# EAGLE design eTapper1main57 (EAGLE 8.5.2)
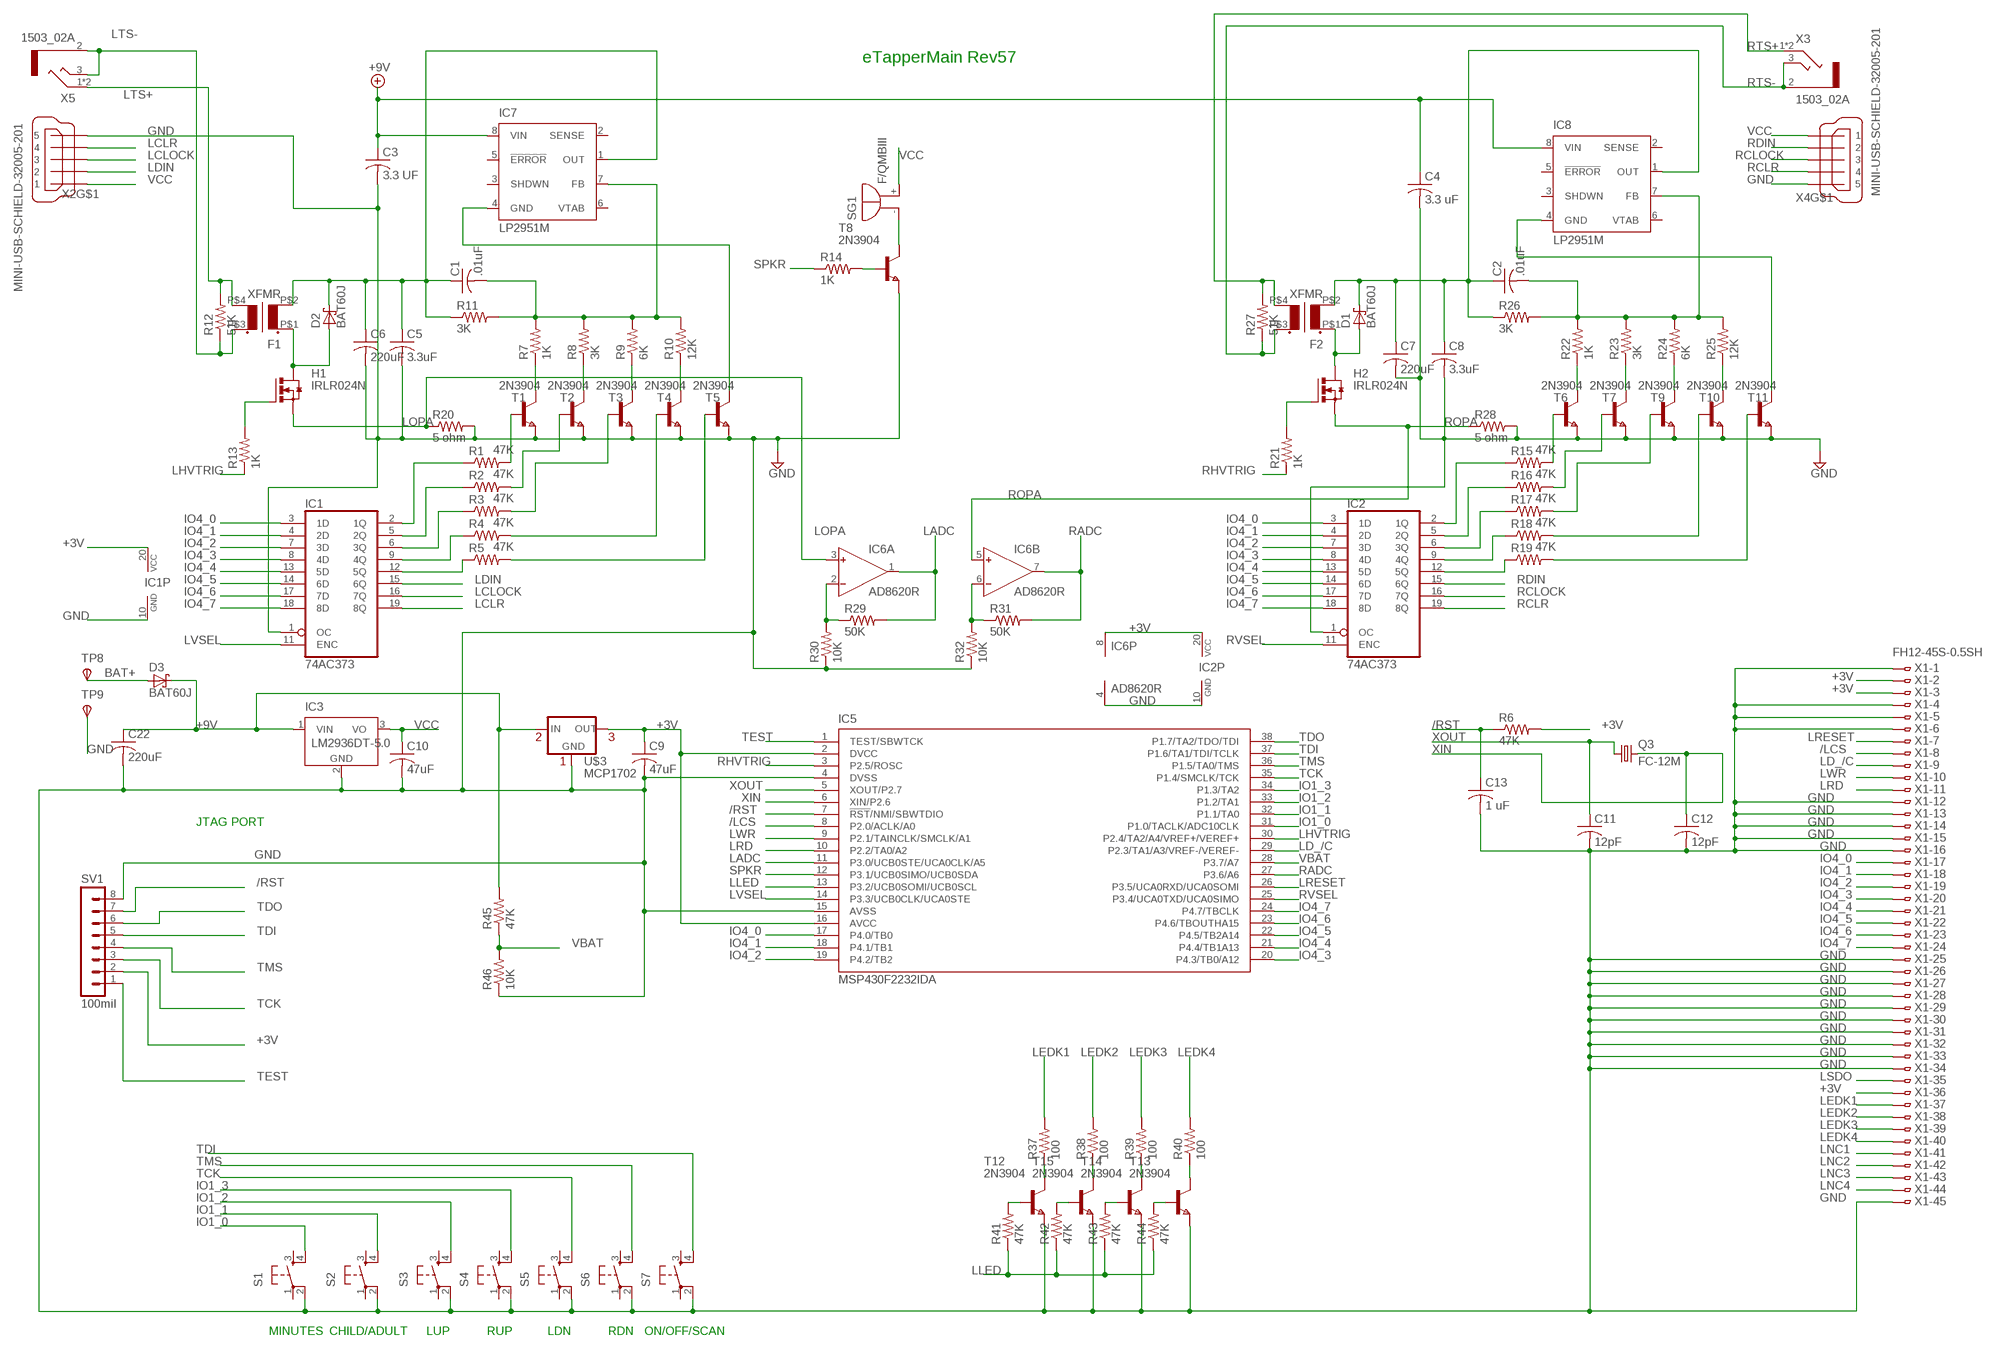
[diagram p0: schematic, sheet 1]

## Parts
C1  .01uF  C-USC0805  [C0805]
C2  .01uF  C-USC0805  [C0805]
C3  3.3 UF  C-USC1206  [C1206]
C4  3.3 uF  C-USC1206  [C1206]
C5  3.3uF  C-USC0805  [C0805]
C6  220uF  C-USC1206  [C1206]
C7  220uF  C-USC1206  [C1206]
C8  3.3uF  C-USC0805  [C0805]
C9  47uF  C-USC1206  [C1206]
C10  47uF  C-USC1206  [C1206]
C11  12pF  C-USC0805  [C0805]
C12  12pF  C-USC0805  [C0805]
C13  1 uF  C-USC0805  [C0805]
C22  220uF  C-USC1206  [C1206]
D1  BAT60J  [SOD323_ST]
D2  BAT60J  [SOD323_ST]
D3  BAT60J  [SOD323_ST]
F1  XFMR  [XFMR]
F2  XFMR  [XFMR]
H1  IRLR024N  [D-PAK_TO252AA]
H2  IRLR024N  [D-PAK_TO252AA]
IC1  74AC373  [SO20]
IC2  74AC373  [SO20]
IC3  LM2936DT-5.0  [TO252]
IC5  MSP430F2232IDA  [TSSOP38_R-PDSO-G38-DA]
IC6  AD8620R  [SO8]
IC7  LP2951M  [SO08]
IC8  LP2951M  [SO08]
Q3  FC-12M  [FC-12M]
R1  47K  R-US_R0603  [R0603]
R2  47K  R-US_R0603  [R0603]
R3  47K  R-US_R0603  [R0603]
R4  47K  R-US_R0603  [R0603]
R5  47K  R-US_R0603  [R0603]
R6  47K  R-US_R0603  [R0603]
R7  1K  R-US_R0603  [R0603]
R8  3K  R-US_R0603  [R0603]
R9  6K  R-US_R0603  [R0603]
R10  12K  R-US_R0603  [R0603]
R11  3K  R-US_R0603  [R0603]
R12  51K  R-US_R0603  [R0603]
R13  1K  R-US_R0603  [R0603]
R14  1K  R-US_R0603  [R0603]
R15  47K  R-US_R0603  [R0603]
R16  47K  R-US_R0603  [R0603]
R17  47K  R-US_R0603  [R0603]
R18  47K  R-US_R0603  [R0603]
R19  47K  R-US_R0603  [R0603]
R20  5 ohm  R-US_R0603  [R0603]
R21  1K  R-US_R0603  [R0603]
R22  1K  R-US_R0603  [R0603]
R23  3K  R-US_R0603  [R0603]
R24  6K  R-US_R0603  [R0603]
R25  12K  R-US_R0603  [R0603]
R26  3K  R-US_R0603  [R0603]
R27  51K  R-US_R0603  [R0603]
R28  5 ohm  R-US_R0603  [R0603]
R29  50K  R-US_R0603  [R0603]
R30  10K  R-US_R0603  [R0603]
R31  50K  R-US_R0603  [R0603]
R32  10K  R-US_R0603  [R0603]
R37  100  R-US_R0603  [R0603]
R38  100  R-US_R0603  [R0603]
R39  100  R-US_R0603  [R0603]
R40  100  R-US_R0603  [R0603]
R41  47K  R-US_R0603  [R0603]
R42  47K  R-US_R0603  [R0603]
R43  47K  R-US_R0603  [R0603]
R44  47K  R-US_R0603  [R0603]
R45  47K  R-US_R0603  [R0603]
R46  10K  R-US_R0603  [R0603]
S1  10-XX  [B3F-10XX]
S2  10-XX  [B3F-10XX]
S3  10-XX  [B3F-10XX]
S4  10-XX  [B3F-10XX]
S5  10-XX  [B3F-10XX]
S6  10-XX  [B3F-10XX]
S7  10-XX  [B3F-10XX]
SG1  F/QMBIII  [F/QMBIII]
SV1  100mil  MA08-1  [MA08-1]
T1  2N3904  NPNSOT23  [SOT-23]
T2  2N3904  NPNSOT23  [SOT-23]
T3  2N3904  NPNSOT23  [SOT-23]
T4  2N3904  NPNSOT23  [SOT-23]
T5  2N3904  NPNSOT23  [SOT-23]
T6  2N3904  NPNSOT23  [SOT-23]
T7  2N3904  NPNSOT23  [SOT-23]
T8  2N3904  NPNSOT23  [SOT-23]
T9  2N3904  NPNSOT23  [SOT-23]
T10  2N3904  NPNSOT23  [SOT-23]
T11  2N3904  NPNSOT23  [SOT-23]
T12  2N3904  NPNSOT23  [SOT-23]
T13  2N3904  NPNSOT23  [SOT-23]
T14  2N3904  NPNSOT23  [SOT-23]
T15  2N3904  NPNSOT23  [SOT-23]
TP8  TPSPAD1-20  [P1-20]
TP9  TPSPAD1-20  [P1-20]
U$3  MCP1702  [TO92-]
X1  FH12-45S-0.5SH  [FH12-45S-0.5SH]
X2  MINI-USB-SCHIELD-32005-201  [32005-201]
X3  1503_02A  [1503_02]
X4  MINI-USB-SCHIELD-32005-201  [32005-201]
X5  1503_02A  [1503_02]

## Nets
+3V [+3V]: C9.1 IC1.20(VCC) IC2.20(VCC) IC5.2(DVCC) IC5.16(AVCC) IC6.8(P:V+) R6.2 SV1.2 U$3.3(OUT) X1.2 X1.3 X1.36
+9V [+9V]: C3.1 C4.1 C22.1 D3.C IC3.1(VIN) IC7.8(VIN) IC8.8(VIN) R45.2 U$3.2(IN)
/LCS: IC5.8(P2.0/ACLK/A0) X1.8
/RST: C13.1 IC5.7(!RST!/NMI/SBWTDIO) R6.1 SV1.7
BAT+ [BAT+]: D3.A TP8.TP(PP)
GND [GND]: C3.2 C4.2 C5.2 C6.2 C7.2 C8.2 C9.2 C10.2 C11.2 C12.2 C13.2 C22.2 IC1.1(OC) IC1.10(GND) IC2.1(OC) IC2.10(GND) IC3.2(GND) IC5.4(DVSS) IC5.15(AVSS) IC6.4(P:V-) R20.2 R28.2 R30.1 R32.1 R46.1 S1.2(P1) S2.2(P1) S3.2(P1) S4.2(P1) S5.2(P1) S6.2(P1) S7.2(P1) SV1.8 T1.2(E) T2.2(E) T3.2(E) T4.2(E) T5.2(E) T6.2(E) T7.2(E) T8.2(E) T9.2(E) T10.2(E) T11.2(E) T12.2(E) T13.2(E) T14.2(E) T15.2(E) TP9.TP(PP) U$3.1(GND) X1.1 X1.4 X1.5 X1.6 X1.12 X1.13 X1.14 X1.15 X1.16 X1.25 X1.26 X1.27 X1.28 X1.29 X1.30 X1.31 X1.32 X1.33 X1.34 X1.45 X2.5 X4.5
IO1_0: IC5.31(P1.0/TACLK/ADC10CLK) S1.4(S1)
IO1_1: IC5.32(P1.1/TA0) S2.4(S1)
IO1_2: IC5.33(P1.2/TA1) S3.4(S1)
IO1_3: IC5.34(P1.3/TA2) S4.4(S1)
IO4_0: IC1.3(1D) IC2.3(1D) IC5.17(P4.0/TB0) X1.17
IO4_1: IC1.4(2D) IC2.4(2D) IC5.18(P4.1/TB1) X1.18
IO4_2: IC1.7(3D) IC2.7(3D) IC5.19(P4.2/TB2) X1.19
IO4_3: IC1.8(4D) IC2.8(4D) IC5.20(P4.3/TB0/A12) X1.20
IO4_4: IC1.13(5D) IC2.13(5D) IC5.21(P4.4/TB1A13) X1.21
IO4_5: IC1.14(6D) IC2.14(6D) IC5.22(P4.5/TB2A14) X1.22
IO4_6: IC1.17(7D) IC2.17(7D) IC5.23(P4.6/TBOUTHA15) X1.23
IO4_7: IC1.18(8D) IC2.18(8D) IC5.24(P4.7/TBCLK) X1.24
LADC: IC5.11(P3.0/UCB0STE/UCA0CLK/A5) IC6.1(A:OUT) R29.2
LCLOCK: IC1.16(7Q) X2.3
LCLR: IC1.19(8Q) X2.4
LD_/C: IC5.29(P2.3/TA1/A3/VREF-/VEREF-) X1.9
LDIN: IC1.15(6Q) X2.2
LEDK1: R37.2 X1.37
LEDK2: R38.2 X1.38
LEDK3: R39.2 X1.39
LEDK4: R40.2 X1.40
LHVTRIG: IC5.30(P2.4/TA2/A4/VREF+/VEREF+) R13.1
LLED: IC5.13(P3.2/UCB0SOMI/UCB0SCL) R41.1 R42.1 R43.1 R44.1
LNC1: X1.41
LNC2: X1.42
LNC3: X1.43
LNC4: X1.44
LOPA: H1.3(S) IC6.3(A:IN+) R20.1
LRD: IC5.10(P2.2/TA0/A2) X1.11
LRESET: IC5.26(P3.5/UCA0RXD/UCA0SOMI) X1.7
LSDO: X1.35
LTS+: F1.P$4(S2) R12.2 X5.1 X5.4
LTS-: F1.P$3(S1) R12.1 X5.2 X5.3
LVSEL: IC1.11(ENC) IC5.14(P3.3/UCB0CLK/UCA0STE)
LWR: IC5.9(P2.1/TAINCLK/SMCLK/A1) X1.10
N$1: IC1.2(1Q) R1.1
N$2: IC1.5(2Q) R2.1
N$3: IC1.6(3Q) R3.1
N$4: IC1.9(4Q) R4.1
N$5: IC1.12(5Q) R5.1
N$6: SG1.-(+) T8.1(C)
N$7: R4.2 T4.3(B)
N$8: R5.2 T5.3(B)
N$9: D2.A F1.P$1(P1) H1.4(D)
N$10: R7.1 T1.1(C)
N$11: R8.1 T2.1(C)
N$12: R9.1 T3.1(C)
N$13: R1.2 T1.3(B)
N$14: R2.2 T2.3(B)
N$15: R3.2 T3.3(B)
N$16: R10.1 T4.1(C)
N$17: C1.2 IC7.7(FB) R7.2 R8.2 R9.2 R10.2 R11.2
N$18: C1.1 C5.1 C6.1 D2.C F1.P$2(P2) IC7.1(OUT) R11.1
N$19: D1.A F2.P$1(P1) H2.4(D)
N$20: IC2.2(1Q) R15.1
N$21: H1.1(G) R13.2
N$22: R14.2 T8.3(B)
N$24: IC2.5(2Q) R16.1
N$25: IC2.6(3Q) R17.1
N$26: IC2.9(4Q) R18.1
N$27: IC2.12(5Q) R19.1
N$28: R44.2 T13.3(B)
N$29: R15.2 T6.3(B)
N$30: R16.2 T7.3(B)
N$31: R17.2 T9.3(B)
N$32: R18.2 T10.3(B)
N$33: R19.2 T11.3(B)
N$35: R22.1 T6.1(C)
N$36: R23.1 T7.1(C)
N$37: R24.1 T9.1(C)
N$38: R25.1 T10.1(C)
N$39: C2.2 IC8.7(FB) R22.2 R23.2 R24.2 R25.2 R26.2
N$40: C2.1 C7.1 C8.1 D1.C F2.P$2(P2) IC8.1(OUT) R26.1
N$41: R37.1 T12.1(C)
N$42: H2.1(G) R21.2
N$43: R38.1 T15.1(C)
N$44: R39.1 T14.1(C)
N$45: IC7.4(GND) T5.1(C)
N$46: R40.1 T13.1(C)
N$47: IC8.4(GND) T11.1(C)
N$48: R43.2 T14.3(B)
N$49: R41.2 T12.3(B)
N$50: R42.2 T15.3(B)
N$52: IC6.6(B:IN-) R31.1 R32.2
N$54: IC6.2(A:IN-) R29.1 R30.2
RADC: IC5.27(P3.6/A6) IC6.7(B:OUT) R31.2
RCLOCK: IC2.16(7Q) X4.3
RCLR: IC2.19(8Q) X4.4
RDIN: IC2.15(6Q) X4.2
RHVTRIG: IC5.3(P2.5/ROSC) R21.1
ROPA: H2.3(S) IC6.5(B:IN+) R28.1
RTS+: F2.P$4(S2) R27.2 X3.1 X3.4
RTS-: F2.P$3(S1) R27.1 X3.2 X3.3
RVSEL: IC2.11(ENC) IC5.25(P3.4/UCA0TXD/UCA0SIMO)
SPKR: IC5.12(P3.1/UCB0SIMO/UCB0SDA) R14.1
TCK: IC5.35(P1.4/SMCLK/TCK) S5.4(S1) SV1.3
TDI: IC5.37(P1.6/TA1/TDI/TCLK) S7.4(S1) SV1.5
TDO: IC5.38(P1.7/TA2/TDO/TDI) SV1.6
TEST: IC5.1(TEST/SBWTCK) SV1.1
TMS: IC5.36(P1.5/TA0/TMS) S6.4(S1) SV1.4
VBAT: IC5.28(P3.7/A7) R45.1 R46.2
VCC [VCC]: C10.1 IC3.3(VO) SG1.+(-) X2.1 X4.1
XIN: C12.1 IC5.6(XIN/P2.6) Q3.2
XOUT: C11.1 IC5.5(XOUT/P2.7) Q3.1
Unconnected: IC7.2(SENSE) IC7.3(SHDWN) IC7.5(!ERROR) IC7.6(VTAB) IC8.2(SENSE) IC8.3(SHDWN) IC8.5(!ERROR) IC8.6(VTAB) S1.1(P) S1.3(S) S2.1(P) S2.3(S) S3.1(P) S3.3(S) S4.1(P) S4.3(S) S5.1(P) S5.3(S) S6.1(P) S6.3(S) S7.1(P) S7.3(S) X2.M1(S:S1) X2.M2(S:S2) X2.M3(S:S3) X2.M4(S:S4) X4.M1(S:S1) X4.M2(S:S2) X4.M3(S:S3) X4.M4(S:S4)

## Notes on the sheet
- eTapperMain Rev57
- JTAG PORT
- MINUTES | CHILD/ADULT | LUP | RUP | LDN | RDN | ON/OFF/SCAN

## Library data of the parts
C1-C13 C22 = rcl:C-US: CAPACITOR, American symbol; SPICEPREFIX: C
D1-D3 = diode:BAT60J: Schottky barrier diode Source: www.st.com, BAT60J.pdf
F1 F2 = XFMR1:XFMR: Transformer 1"X1" 0.4"X0.4" hole separation for e_tapper
H1 H2 = IRLR024N:IRLR024N: IRLR024N HEXFET Power Mosfet N channel Infeneon Technology TO-251AA IPAK
IC1 IC2 = 74373_SO20:74*373: Octal D type transparent LATCH, edge triggered
IC3 = national-semiconductor:LM2936?*: Ultra-Low Quiescent Current LDO Voltage Regulator Source: Data sheet <http://www.national.com/ds/LM/LM2936.pdf>; MF: NATIONAL SEMICONDUCTOR; MPN: LM2936DT-5.0/NOPB; OC_FARNELL: 1286864; OC_NEWARK: 41K4501
IC5 = texas:MSP430F22*2IDA: MIXED SIGNAL MICROCONTROLLER Source: http://focus.ti.com/lit/ds/symlink/msp430f2274.pdf; MPN: MSP430F2232IDA; OC_FARNELL: 1610178; OC_NEWARK: 28M6312
IC6 = analog-devices:AD8620: Precision, Very Low Noise, Low Input Bias Current, Wide Bandwidth JFET Operational Amplifiers Source: http://www.analog.com/static/imported-files/data_sheets/AD8610_8620.pdf; MF: ALTERA CORPORATION; MPN: AD8620ARZ; OC_FARNELL: 9994386; OC_NEWARK: 59K6972
IC7 IC8 = national-semiconductor:LP2951: Adjustable Micropower Voltage Regulator Source: http://www.national.com/ds/LP/LP2950.pdf; MF: FAIRCHILD SEMICONDUCTOR; MPN: LP2951CM; OC_FARNELL: 9488561; OC_NEWARK: 78K6014
Q3 = crystal:FC-12M: kHz RANGE CRYSTAL UNIT LOW PROFILE SMD Source: Epson Toyocom FC-12M.pdf
R1-R32 R37-R46 = resistor:R-US_: RESISTOR, American symbol
S1-S7 = switch-omron:10-XX: OMRON SWITCH; MPN: B3F-1000; OC_FARNELL: 176432; OC_NEWARK: 36M3542
SG1 = buzzer:F/QMBIII: BUZZER Source: Buerklin; OC_FARNELL: unknown; OC_NEWARK: unknown
SV1 = eTapper1main39:MA08-1: PIN HEADER; OC_FARNELL: unknown; OC_NEWARK: unknown
T1-T15 = zetex:NPNSOT23: NPN TRANSISTOR; MPN: DSS20201L-7; OC_FARNELL: 1710688; OC_NEWARK: 25R4555
TP8 TP9 = testpad:TPS: TEST PIN
U$3 = mcp1702:MCP1702: MCP1702 LDO Fixed Voltage regulator
X1 = con-hirose:FH12-45S-0.5S: 0.5mm Pitch Connectors For FPC/FFC Source: Data sheet <http://www.hirose.co.jp/cataloge_hp/e58605370.pdf>; OC_FARNELL: unknown; OC_NEWARK: unknown
X2 X4 = con-cypressindustries:MINI-USB-SCHIELD-: MINI USB-B Conector Source: www.cypressindustries.com; OC_FARNELL: unknown; OC_NEWARK: unknown
X3 X5 = 1503_02Astereojacks:1503_02A

## Module LP2951
Ports: 

### Library data of the parts

## Net classes
1 GND: width 0.305 mm, clearance 0.152 mm
2 BAT+: width 0.305 mm, clearance 0.152 mm
3 +9V: width 0.305 mm, clearance 0.152 mm
4 +3V: width 0.305 mm, clearance 0.152 mm
5 VCC: width 0.305 mm, clearance 0.152 mm

## Board
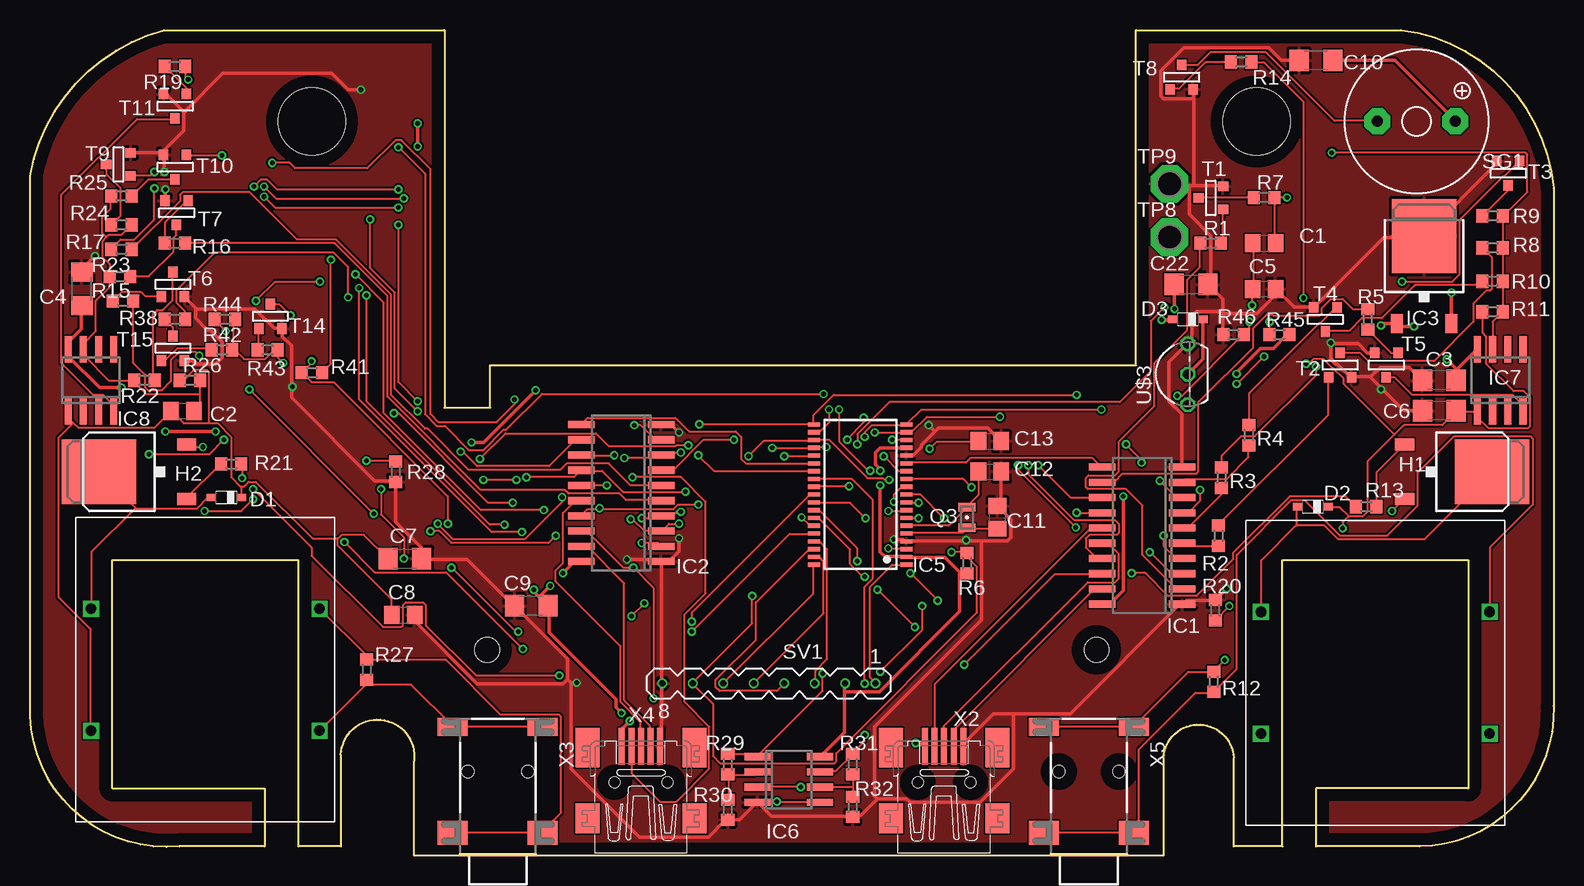
[diagram p1: board, top side]
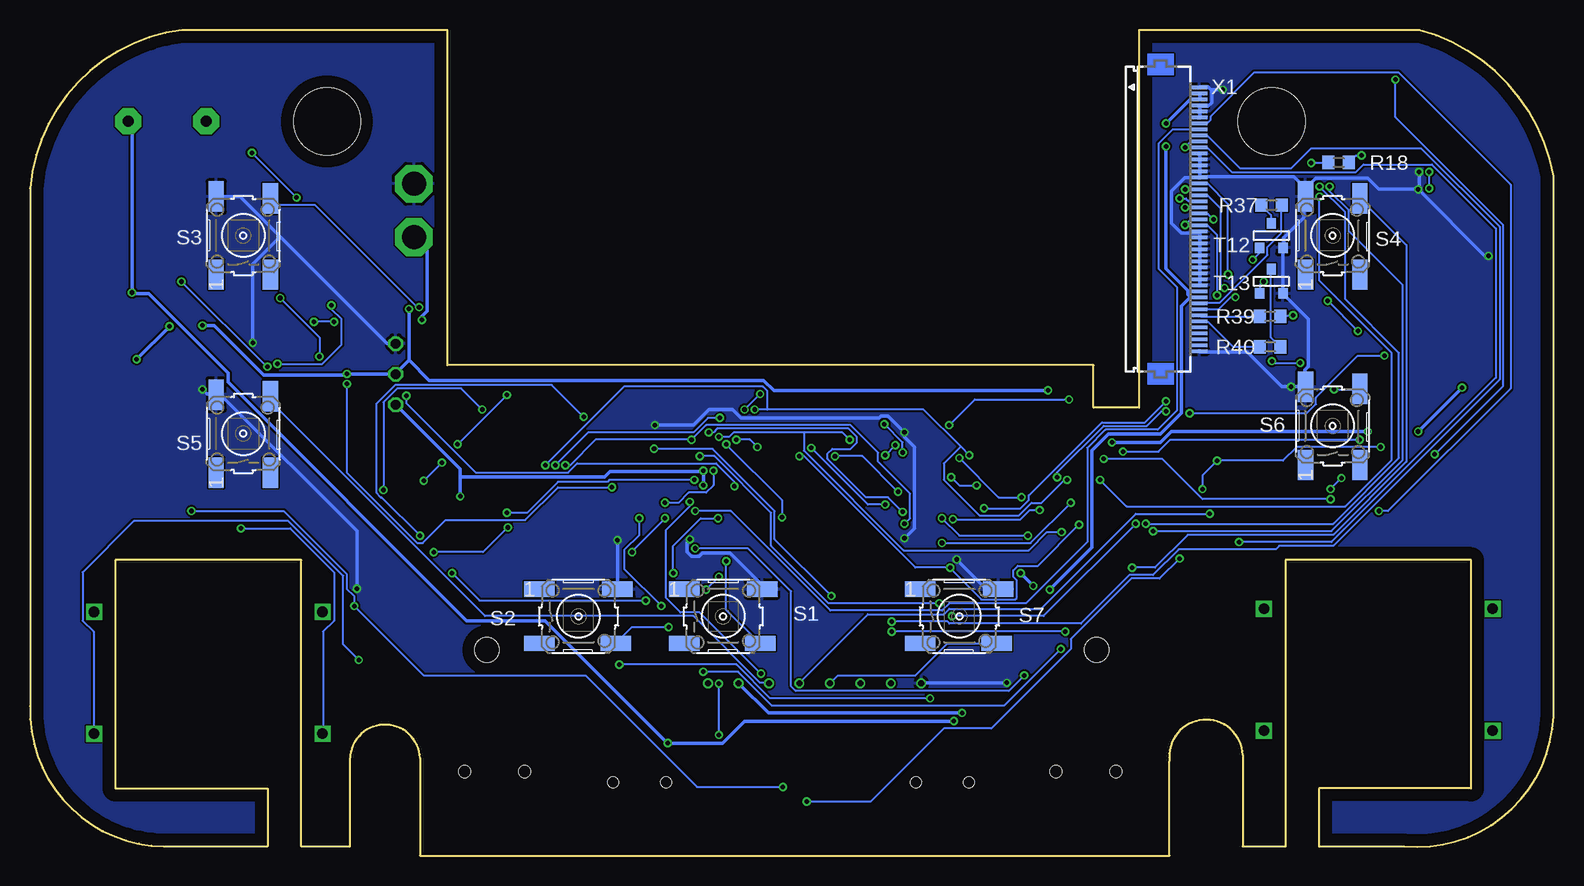
[diagram p2: board, bottom side, seen from below]

Size 127 x 68.83 mm. Coordinates in mm from the lower left corner, seen from the top.
Outline: 104.4,24.64 119.89,24.64 119.89,5.59 107.19,5.59 107.19,0.76 115.83,0.76 arc91 127,12.45 127,55.63 arc78 114.3,68.83 92.21,68.83 92.21,40.89 38.36,40.89 38.36,37.34 34.55,37.34 34.55,68.83 11.18,68.83 arc65 0,56.64 0,12.7 arc98 12.45,0.76 19.56,0.76 19.56,5.59 6.86,5.59 6.86,24.64 22.36,24.64 22.36,0.76 25.91,0.76 25.91,8.38 arc-185 32.01,7.87 32.01,0 94.49,0 94.49,8.13 arc-175 100.33,8.13 100.33,0.76 104.4,0.76 104.4,24.64
Copper layers (1*16): Top 0.035mm / dielectric 30mil / Bottom 0.035mm
Design rules "default *": minimum track width 6mil, minimum drill 15mil, track to track 6mil, track to pad 6mil, pad to pad 6mil, via to via 6mil, smd to smd 6mil, copper to edge 40mil, drill to drill 6mil, minimum pad ring 6mil, minimum via ring 6mil, stop-mask expansion 4mil, vias tented up to drill 0mil, thermal gap 10mil
Holes 5.59 mm at 23.5,61.21 102.24,61.21
Holes 2.03 mm at 38.1,17.14 88.9,17.14

### Footprints (pad centres in the part's own frame; a part is rotated, then mirrored left to right if it is on the bottom)
C0805 = smd 1.3 x 1.5: 1 -0.95,0; 2 0.95,0
C1206 = smd 1.6 x 1.8: 1 -1.4,0; 2 1.4,0
SOD323_ST = smd 0.8 x 0.6: A 1.25,0; C -1.25,0
XFMR = drill 0.889 square: P$1 -10.16,5.08; P$2 -10.16,-5.08; P$3 8.89,5.08; P$4 8.89,-5.08
D-PAK_TO252AA = smd 1 x 1.6: 1 -2.28,-4.8; 3 2.28,-4.8 | smd 5.4 x 6.2: 4 0,2.5
SO20 = smd 0.6 x 2.2: 1 -5.715,-3.33; 2 -4.445,-3.33; 3 -3.175,-3.33; 4 -1.905,-3.33; 5 -0.635,-3.33; 6 0.635,-3.33; 7 1.905,-3.33; 8 3.175,-3.33; 9 4.445,-3.33; 10 5.715,-3.33; 11 5.715,3.33; 12 4.445,3.33; 13 3.175,3.33; 14 1.905,3.33; 15 0.635,3.33; 16 -0.635,3.33; 17 -1.905,3.33; 18 -3.175,3.33; 19 -4.445,3.33; 20 -5.715,3.33
TO252 = smd 1 x 1.6: 1 -2.28,-4.8; 3 2.28,-4.8 | smd 5.4 x 6.2: 2 0,2.5
TSSOP38_R-PDSO-G38-DA = smd 0.35 x 1: 1 -5.85,-3.85; 2 -5.2,-3.85; 3 -4.55,-3.85; 4 -3.9,-3.85; 5 -3.25,-3.85; 6 -2.6,-3.85; 7 -1.95,-3.85; 8 -1.3,-3.85; 9 -0.65,-3.85; 10 0,-3.85; 11 0.65,-3.85; 12 1.3,-3.85; 13 1.95,-3.85; 14 2.6,-3.85; 15 3.25,-3.85; 16 3.9,-3.85; 17 4.55,-3.85; 18 5.2,-3.85; 19 5.85,-3.85; 20 5.85,3.85; 21 5.2,3.85; 22 4.55,3.85; 23 3.9,3.85; 24 3.25,3.85; 25 2.6,3.85; 26 1.95,3.85; 27 1.3,3.85; 28 0.65,3.85; 29 0,3.85; 30 -0.65,3.85; 31 -1.3,3.85; 32 -1.95,3.85; 33 -2.6,3.85; 34 -3.25,3.85; 35 -3.9,3.85; 36 -4.55,3.85; 37 -5.2,3.85; 38 -5.85,3.85
SO8 = smd 0.6 x 2.2: 1 -1.905,-2.6; 2 -0.635,-2.6; 3 0.635,-2.6; 4 1.905,-2.6; 5 1.905,2.6; 6 0.635,2.6; 7 -0.635,2.6; 8 -1.905,2.6
SO08 = smd 0.6 x 2.2: 1 -1.905,-2.6; 2 -0.635,-2.6; 3 0.635,-2.6; 4 1.905,-2.6; 5 1.905,2.6; 6 0.635,2.6; 7 -0.635,2.6; 8 -1.905,2.6
FC-12M = smd 0.7 x 1.4: 1 -0.85,0; 2 0.85,0
R0603 = smd 1 x 1.1: 1 -0.85,0; 2 0.85,0
B3F-10XX = smd 2.54 x 1.27: 1 -3.251,2.261; 2 3.251,2.261; 3 -3.251,-2.261; 4 3.099,-2.261
F/QMBIII = drill 0.914 pad 2.159 octagon: + 3.251,0; - -3.251,0
MA08-1 = drill 0.508: 1 -8.89,0; 2 -6.35,0; 3 -3.81,0; 4 -1.27,0; 5 1.27,0; 6 3.81,0; 7 6.35,0; 8 8.89,0
SOT-23 = smd 0.787 x 0.889: 1 0.025,-1.016; 2 -0.94,1.016; 3 0.991,1.016
P1-20 = drill 2.007 pad 3.15 octagon: TP 0,0
TO92- = drill 0.813 octagon: 1 -1.27,1.27; 2 1.27,1.27; 3 3.81,1.27
FH12-45S-0.5SH = smd 0.3 x 1.3: 1 -13,3.25; 2 -12.5,3.25; 3 -12,3.25; 4 -11.5,3.25; 5 -11,3.25; 6 -10.5,3.25; 7 -10,3.25; 8 -9.5,3.25; 9 -9,3.25; 10 -8.5,3.25; 11 -8,3.25; 12 -7.5,3.25; 13 -7,3.25; 14 -6.5,3.25; 15 -6,3.25; 16 -5.5,3.25; 17 -5,3.25; 18 -4.5,3.25; 19 -4,3.25; 20 -3.5,3.25; 21 -3,3.25; 22 -2.5,3.25; 23 -2,3.25; 24 -1.5,3.25; 25 -1,3.25; 26 -0.5,3.25; 27 0,3.25; 28 0.5,3.25; 29 1,3.25; 30 1.5,3.25; 31 2,3.25; 32 2.5,3.25; 33 3,3.25; 34 3.5,3.25; 35 4,3.25; 36 4.5,3.25; 37 5,3.25; 38 5.5,3.25; 39 6,3.25; 40 6.5,3.25; 41 7,3.25; 42 7.5,3.25; 43 8,3.25; 44 8.5,3.25; 45 9,3.25
32005-201 = smd 3.1 x 0.5: 1 3,1.6; 2 3,0.8; 3 3,0; 4 3,-0.8; 5 3,-1.6 | smd 2.5 x 2: M1 -3,-4.45; M2 -3,4.45 | smd 3.3 x 2: M3 2.9,4.45; M4 2.9,-4.45 | hole 0.9: 0,2.2; 0,-2.2
1503_02 = smd 2.5 x 1.5: 1 -3.75,-10.75; 4 3.75,-10.75 | smd 2.5 x 2: 2 -3.75,-1.9; 3 3.75,-1.9 | hole 1: -2.5,-7; 2.5,-7

### Placement (x,y rotation side)
C1  102.87,51.05 0 top
C2  12.7,37.08 0 top
C3  117.48,39.62 180 top
C4  4.32,47.24 90 top
C5  102.87,47.24 0 top
C6  117.48,37.08 180 top
C7  31.25,24.77 0 top
C8  31.12,20.07 0 top
C9  41.79,20.83 180 top
C10  107.19,66.29 180 top
C11  80.65,28.19 90 top
C12  80.01,32 0 top
C13  80.01,34.54 0 top
C22  96.78,47.62 0 top
D1  16.39,29.85 180 top
D2  106.94,29.08 180 top
D3  96.52,44.7 180 top
DRILEGEND  [DRILEGEND]  -4.57,-8.21 0 top  (outside the outline)
F1  112.78,15.24 0 top
F2  15.24,15.49 0 top
H1  119.38,32 270 top
H2  8.26,32 90 top
IC1  92.71,26.67 90 top
IC2  49.28,30.23 90 top
IC3  116.21,49.15 0 top
IC5  69.22,30.1 90 top
IC6  63.25,6.35 270 top
IC7  122.56,39.62 0 top
IC8  5.08,39.62 0 top
Q3  78.11,28.19 90 top
R1  98.43,51.05 0 top
R2  99.06,26.67 90 top
R3  99.32,31.5 90 top
R4  101.6,35.05 90 top
R5  111.51,44.7 270 top
R6  78.11,24.38 270 top
R7  102.87,54.86 0 top
R8  121.92,50.67 0 top
R9  121.92,53.34 0 top
R10  121.92,47.88 0 top
R11  121.92,45.34 0 top
R12  98.68,14.48 90 top
R13  111.38,29.08 0 top
R14  100.97,66.17 180 top
R15  7.75,46.23 180 top
R16  12.07,51.05 180 top
R17  7.62,50.55 180 top
R18  17.91,57.78 0 bottom
R19  12.07,65.79 180 top
R20  98.81,20.45 90 top
R21  16.77,32.64 180 top
R22  9.53,39.62 180 top
R23  7.5,48.26 180 top
R24  7.62,52.58 0 top
R25  7.62,54.99 180 top
R26  13.34,39.62 0 top
R27  28.07,15.49 270 top
R28  30.48,32 270 top
R29  58.17,7.62 90 top
R30  58.17,3.81 90 top
R31  68.58,7.62 90 top
R32  68.58,4.06 90 top
R37  23.5,54.23 0 bottom
R38  12.07,44.7 0 top
R39  23.63,44.96 180 bottom
R40  23.63,42.42 180 bottom
R41  23.5,40.26 0 top
R42  16.01,42.16 180 top
R43  19.82,42.16 180 top
R44  16.26,44.7 180 top
R45  104.14,43.43 0 top
R46  100.33,43.43 0 top
S1  69.22,19.94 0 bottom
S2  81.28,19.94 0 bottom
S3  109.22,51.69 90 bottom
S4  18.42,51.69 90 bottom
S5  109.22,35.18 90 bottom
S6  18.42,35.81 90 bottom
S7  49.53,19.94 0 bottom
SG1  115.57,61.21 0 top
SV1  61.6,14.35 180 top
T1  98.43,54.86 270 top
T2  109.22,40.89 180 top
T3  123.19,56.9 0 top
T4  107.95,44.7 0 top
T5  113.03,40.89 0 top
T6  11.94,47.62 180 top
T7  12.2,53.59 0 top
T8  96.02,64.9 180 top
T9  7.37,57.66 270 top
T10  12.07,57.4 0 top
T11  12.07,62.48 0 top
T12  23.5,51.69 180 bottom
T13  23.5,47.88 180 bottom
T14  20.07,44.96 180 top
T15  11.94,42.29 180 top
TP8  95,51.56 0 top
TP9  95,56.01 0 top
U$3  95.25,41.4 270 top
X1  32.77,51.05 270 bottom
X2  76.2,6.1 90 top
X3  38.99,0 180 top
X4  50.93,6.1 90 top
X5  88.27,0 180 top

### Tracks (layer width: path | path; a pad name or v marks a point on that pad's centre or on a via)
+3V  (via drill 0.38)
  Top 0.305: v41.99,22.17 41.99,22.02 43.13,20.88 C9.1 | v32.31,59.13 v32.31,61.04 | v44.43,23.55 45.34,24.46 45.88,24.46 IC2.20 | v43.36,22.48 42.52,21.64 C9.1 | IC1.20 90,20.96 91.14,22.1 v91.14,29.95 | 67.9,13.64 67.9,10.29 65.92,8.31 IC6.8 | 67.9,13.64 67.9,14.33 SV1.2 | 77.58,23.55 76.28,24.84 73.08,24.84 IC5.2 72.93,24.92 71.25,24.92 70.87,25.3 v70.87,30.86 | 77.58,23.55 78.11,23.55 R6.2 | v70.87,32.08 70.87,32.23 70.49,32.61 70.49,33.6 70.87,33.98 73,33.98 IC5.16 | 67.9,13.64 70.79,13.64 77.5,20.35 77.5,23.47 77.58,23.55 | v49.31,11.89 48.85,12.34 48.85,13.03 43.29,18.59 43.29,20.73 C9.1
  Bottom 0.305: X1.2 29.49,63.55 29.49,63.09 X1.3 29.65,63.02 30.33,63.02 v32.31,61.04 | 30.26,46.56 29.57,46.56 X1.36 | 30.26,46.56 31.02,45.8 31.02,36.88 32.77,35.13 37.11,35.13 38.49,33.76 38.49,25.68 v41.99,22.17 | v32.31,59.13 32.31,48.92 30.48,47.09 30.48,46.79 30.26,46.56 | v43.36,22.48 v44.43,23.55 | 91.14,31.55 91.14,32.23 96.47,37.57 U$3.3 | 91.14,31.55 v91.14,29.95 | v70.87,30.86 v70.87,32.08 70.95,32 78.64,32 79.1,31.55 91.14,31.55 | v49.31,11.89 65.46,11.89 67.9,14.33 SV1.2
+9V  (via drill 0.38)
  Top 0.305: C4.1 4.27,45.8 4.27,43.89 3.2,42.82 3.2,42.29 IC8.8 3.28,42.14 3.28,41.53 5.8,39.01 v7.62,39.01 | 118.95,40.54 118.95,39.62 C3.1 | 118.95,40.54 120.63,42.21 IC7.8 | U$3.2 97.77,41.38 97.77,44.65 D3.C | R45.2 104.78,43.43 103.64,42.29 102.57,42.29 100.59,40.31 v100.59,40.16 | v112.63,44.2 112.78,44.35 IC3.1 114.08,44.35 114.3,44.12 v115.37,44.12 | v95.41,45.57 95.41,47.62 C22.1 | v118.11,41.38 118.95,40.54 | v15.47,35.36 v11.28,35.36 | v36.81,34.44 37.8,34.44 v42.14,38.79
  Bottom 0.305: v112.63,44.2 111.64,44.2 107.52,40.08 100.66,40.08 v100.59,40.16 96.55,40.16 U$3.2 96.47,40.23 95.41,41.3 | 95.41,41.3 v95.41,45.57 | v115.37,44.12 v118.11,41.38 | v11.28,35.36 v7.62,39.01 | v15.47,35.36 31.86,35.36 32.77,34.44 v36.81,34.44 | v42.14,38.79 65,38.79 65.84,39.62 93.73,39.62 95.41,41.3
/LCS  (via drill 0.38)
  Top 0.152: v71.56,28.73 73,28.73 IC5.8
  Bottom 0.152: v71.56,28.73 68.58,28.73 60.28,20.42 50.98,20.42 50.37,21.03 43.97,21.03 38.87,26.14 38.87,33.98 37.34,35.51 33,35.51 31.4,37.11 31.4,47.4 32.92,48.92 32.92,59.36 31.78,60.5 29.57,60.5 X1.8
/RST  (via drill 0.38)
  Top 0.152: v74.07,28.12 73.08,28.12 IC5.7 | v76.81,25.3 78.11,25.3 R6.1 78.11,24.92 78.95,24.08 78.95,20.27 67.21,8.53 67.21,7.85 67.06,7.7 57.54,7.7 56.93,8.31 56.93,12.65 55.25,14.33 SV1.7 55.25,14.4 60.2,19.36 v60.2,21.64 | v74.99,33.91 75.59,34.52 79.02,34.52 C13.1
  Bottom 0.152: v74.07,28.12 76.81,25.38 v76.81,25.3 | v74.99,33.91 70.11,33.91 64.93,28.73 64.93,26.37 v60.2,21.64
BAT+  (via drill 0.38)
  Top 0.305: v94.34,44.65 95.25,44.65 D3.A
  Bottom 0.305: v94.34,44.65 94.34,44.96 93.88,45.41 93.88,50.44 TP8.TP
GND  (via drill 0.38)
  Top 0.305: 96.63,55.85 95.18,55.85 95.03,56.01 TP9.TP | 96.63,55.85 97.01,55.85 | 97.01,55.85 99.45,55.85 T1.2 | 97.01,55.85 97.01,63.09 | 97.01,63.09 97.01,63.86 T8.2 | C10.2 104.32,66.29 103.26,67.36 96.17,67.36 94.26,65.46 94.26,63.32 94.49,63.09 97.01,63.09 | T3.2 122.23,57.91 122.23,57.68 IC3.2 116.13,51.51 112.86,51.51 107.14,45.8 T4.2 105.39,45.72 103.87,47.24 C5.2 104.02,46.94 102.26,45.19 99.45,45.19 | 99.45,45.34 99.45,46.41 98.23,47.62 C22.2 98.3,47.7 98.45,47.85 98.45,51.66 96.63,53.49 96.63,55.85 | 99.45,45.34 99.45,45.19 | 99.45,45.19 99.45,43.43 R46.1 | 111.79,39.93 110.19,39.93 T2.2 110.04,39.93 108.97,41 108.82,41 108.44,41.38 108.44,42.44 108.59,42.6 | 111.79,39.93 112.55,40.69 114.99,40.69 116.06,39.62 C3.2 | T5.2 111.49,41.91 110.72,42.67 108.67,42.67 108.59,42.6 | 112.7,38.94 111.79,39.85 111.79,39.93 | 112.7,38.94 114.53,37.11 116.06,37.11 C6.2 | v112.63,38.86 112.7,38.94 | IC1.10 96.02,32.38 96.02,36.8 94.95,37.87 94.95,41.15 96.47,42.67 U$3.1 96.63,42.75 96.85,42.98 96.85,44.96 97.24,45.34 99.45,45.34 | v108.44,42.75 108.59,42.6 | 79.33,26.21 81.46,26.21 81.77,26.52 81.77,28.04 80.7,29.11 C11.2 80.7,29.26 80.93,29.49 80.93,32 C12.2 | 79.33,26.21 78.03,26.21 | 78.03,26.21 73.08,26.21 IC5.4 72.93,26.21 72.78,26.37 v72.01,26.37 | v78.03,26.29 78.03,26.21 | 82,11.81 80.32,11.81 77.8,9.3 77.8,9.14 X2.5 | 82,11.81 86.72,11.81 95.79,20.88 95.94,20.88 IC1.1 96.09,20.96 96.4,21.26 98.76,21.26 R20.2 98.91,21.41 v99.75,22.25 | 70.64,4.72 69.27,3.35 68.66,3.35 R32.1 68.58,3.28 61.8,3.28 60.74,4.34 IC6.4 60.58,4.42 59.14,2.97 58.22,2.97 R30.1 58.07,2.9 57.92,2.9 56.54,1.52 50.83,1.52 45.11,7.24 45.11,14.4
  Top 0.305: 70.64,4.72 73.08,4.72 73.39,4.42 79.18,4.42 82,7.24 82,11.81 | 79.33,26.21 79.33,19.66 70.41,10.74 70.41,4.95 70.64,4.72 | 75.44,35.36 75.75,35.66 79.86,35.66 80.93,34.59 C13.2 | 75.44,35.36 74.3,34.21 74.3,34.06 73.61,33.38 73.08,33.38 IC5.15 | X4.5 52.58,9.14 52.66,9.22 52.66,14.33 SV1.8 52.66,14.48 52.66,24.46 IC2.1 | v54.11,35.28 53.5,35.89 52.66,35.89 IC2.10 | v54.11,26.44 54.11,25.38 53.19,24.46 52.81,24.46 IC2.1 | v49.76,24.69 52.43,24.69 52.51,24.61 IC2.1 | v74.91,35.89 75.44,35.36 | T9.2 10.98,58.6 11.13,58.45 T10.2 | 12.81,62.03 11.36,63.47 11.13,63.47 T11.2 | 12.81,62.03 12.81,60.43 11.05,58.67 T10.2 | v27.59,63.86 26.52,63.86 25.15,65.23 16.08,65.23 12.88,62.03 12.81,62.03 | v11.28,55.55 11.28,54.63 T7.2 | v5.41,49.99 4.35,48.92 4.35,48.69 C4.2 | v11.21,57 11.21,58.29 T10.2 | 13.8,45.57 13.8,45.64 12.88,46.56 T6.2 | 13.8,45.57 13.8,44.81 14.79,43.81 15.02,43.81 16.01,42.82 16.01,41.53 15.47,41 13.8,41 13.57,41.22 12.88,41.22 T15.2 | 13.8,45.57 18.75,45.57 20.35,43.97 20.96,43.97 T14.2 21.04,43.81 21.04,43.28 21.8,42.52 21.8,39.09 | 44.81,14.71 44.43,14.33 37.27,14.33 32.08,19.51 32.08,20.04 C8.2 | 44.81,14.71 44.81,16.38 40.39,20.8 C9.2 40.24,20.88 36.43,24.69 32.77,24.69 C7.2 32.62,24.77 32.62,25.68 30.48,27.81 R28.2 30.41,31.24 28.73,31.24 21.8,38.18 21.8,39.09 | v21.87,39.09 21.8,39.09 | 45.11,14.4 v45.57,14.4 | 44.81,14.71 45.11,14.4
  Bottom 0.305: v112.63,38.86 112.25,38.48 111.49,38.48 S5.2 111.41,38.33 111.03,38.33 99.75,27.05 v99.75,22.25 | S3.2 109.5,54.94 106.15,51.59 | 106.15,51.59 97.24,42.67 U$3.1 | v108.44,42.75 108.44,49.3 106.15,51.59 | v72.01,26.37 72.24,26.14 72.24,25.3 71.86,24.92 71.25,24.92 70.95,25.22 68.66,25.22 65.99,22.55 65.99,22.25 S1.2 | v78.03,26.29 S2.2 | v54.11,26.44 53.27,27.28 53.27,34.06 54.11,34.9 v54.11,35.28 55.48,36.65 56.09,36.65 56.24,36.5 67.75,36.5 68.43,37.19 70.41,37.19 71.71,35.89 v74.91,35.89 | v49.76,24.69 47.32,22.25 46.33,22.25 S7.2 | X1.6 29.49,61.57 29.49,62.03 X1.5 29.49,62.18 29.49,62.48 X1.4 29.34,62.48 28.81,62.48 28.5,62.79 28.5,63.78 | 28.5,63.78 28.81,64.08 29.49,64.08 X1.1 | v27.59,63.86 28.43,63.86 28.5,63.78 | X1.45 29.49,41.99 25.53,41.99 22.64,39.09 v21.87,39.09 20.73,39.09 S6.2 20.73,39.24 20.73,40.46 20.43,40.77 20.43,44.73 T13.2 T12.2 22.48,50.75 22.48,51.51 20.81,53.19 20.81,54.86 S4.2 | X1.16 29.49,56.62 29.49,57 X1.15 29.49,57.15 29.49,57.53 X1.14 29.49,57.68 29.49,57.99 X1.13 29.49,58.14 29.49,58.52 X1.12 | X1.34 29.49,47.62 29.49,48.01 X1.33 29.49,48.16 29.49,48.54 X1.32 29.49,48.69 29.49,49 X1.31 29.49,49.15 29.49,49.53 X1.30 29.49,49.68 29.49,49.99 X1.29 29.49,50.14 29.49,50.52 X1.28 29.49,50.67 29.49,51.05 X1.27 29.49,51.13 29.49,51.51 X1.26 29.49,51.66 29.49,51.89 | 29.49,51.89 29.49,52.04 X1.25 | 29.49,51.89 31.02,51.89 31.86,52.73 31.86,55.4 30.71,56.54 29.65,56.54 X1.16 | v11.28,55.55 14.56,55.55 15.47,56.46 19.82,56.46 20.65,55.63 20.65,54.94 S4.2 | v5.41,49.99 5.72,49.99 v11.28,55.55 | X1.16 29.34,56.62 21.65,56.62 20.73,55.7 S4.2
  Bottom 0.305: v11.21,57 11.21,55.63 v11.28,55.55 | v45.57,14.4 52.66,14.4 SV1.8
  pour Top: 0,69.34 127,69.34 127,0.76 0,0.76
  pour Bottom: 0,69.34 127,69.34 127,0.76 0,0.76
IO1_0  (via drill 0.38)
  Top 0.152: v68.97,24.54 68.97,25.6 65.84,28.73 65.38,28.73 IC5.31
  Bottom 0.152: v68.97,24.54 68.97,20.5 66.15,17.68 S1.4
IO1_1  (via drill 0.38)
  Top 0.152: v69.58,23.24 69.42,23.24 68.36,24.31 68.36,25.53 65.77,28.12 65.38,28.12 IC5.32 | v73.77,19.05 v70.64,22.17
  Bottom 0.152: v70.64,22.17 v69.58,23.24 | v73.77,19.05 76.81,19.05 S2.4
IO1_2  (via drill 0.38)
  Top 0.152: v64.32,28.19 65,27.51 65.31,27.51 IC5.33 | v68.97,34.29 68.97,35.13 71.63,37.79 90.83,37.79 93.43,40.39 93.43,44.58 v94.57,45.72
  Bottom 0.152: v64.32,28.19 64.32,29.64 v68.97,34.29 | v94.57,45.72 94.72,45.72 103.26,54.25 106.38,54.25 106.91,54.79 S3.4
IO1_3  (via drill 0.38)
  Top 0.152: v55.17,18.67 63.33,26.82 65.31,26.82 IC5.34 | v40.7,18.67 40.47,18.67 v35.13,24
  Bottom 0.152: v40.7,18.67 v55.17,18.67 | v35.13,24 33.23,24 30.48,26.75 18.37,26.75 12.27,32.84 12.27,50.9 S4.4
IO4_0  (via drill 0.38)
  Top 0.152: v71.86,34.67 73,34.67 IC5.17 | v54.11,27.66 53.27,27.66 52.66,27.05 IC2.3 51.21,27.05 50.22,28.04 v50.07,28.04 | v27.13,48.46 29.49,46.1 29.49,36.88 37.57,28.8 v42.83,28.8 | v93.35,25.3 95.1,23.55 96.02,23.55 IC1.3 | v87.18,27.36 82.38,32.16 v82.38,32.54
  Bottom 0.152: v54.11,27.66 53.65,28.12 53.65,30.18 56.32,32.84 56.32,33.6 58.6,35.89 70.64,35.89 v71.86,34.67 79.86,34.67 82,32.54 v82.38,32.54 | v27.13,48.46 27.13,54.33 28.81,56.01 29.49,56.01 X1.17 | v42.83,28.8 43.67,28.8 44.43,28.04 v50.07,28.04 | v93.35,25.3 89.23,25.3 v87.18,27.36
IO4_1  (via drill 0.38)
  Top 0.152: v70.41,35.28 73,35.28 IC5.18 73.08,35.36 73.54,35.36 74.76,36.58 v80.85,36.58 | v54.26,28.65 53.88,28.65 53.57,28.35 52.66,28.35 IC2.4 52.58,28.27 52.43,28.12 v50.98,28.12 | v30.71,55.55 20.58,55.55 19.74,56.39 19.28,56.39 v18.67,55.78 | v33.38,27.05 34.14,27.05 35.13,26.06 43.21,26.06 v43.82,26.67 | IC1.4 95.56,24.77 94.49,25.83 v94.49,26.67
  Bottom 0.152: v70.41,35.28 70.03,35.28 69.73,35.59 58.75,35.59 58.07,34.9 58.07,34.44 58.6,33.91 60.13,33.91 60.51,33.53 60.51,33.07 57.31,29.87 55.48,29.87 v54.26,28.65 | v30.71,55.55 29.57,55.55 X1.18 | v18.67,55.78 18.67,55.4 17.07,53.8 17.07,52.04 12.58,47.55 12.58,32.99 18.52,27.05 v33.38,27.05 | v43.82,26.67 49.53,26.67 v50.98,28.12 | v94.49,26.67 97.69,29.87 97.77,29.87 98.15,30.25 98.15,37.64 96.55,39.24 83.52,39.24 v80.85,36.58
IO4_2  (via drill 0.38)
  Top 0.152: v69.58,34.9 69.58,35.28 70.18,35.89 73,35.89 IC5.19 73.08,35.97 74.3,37.19 v89.31,37.19 | v58.68,34.67 56.16,34.67 53.65,32.16 52.66,32.16 IC2.7 | v27.44,47.32 27.44,38.02 38.49,26.98 v41,26.98 | IC1.7 96.55,28.58 97.54,29.57 v97.54,30.48
  Bottom 0.152: v69.58,34.9 68.74,34.9 68.36,35.28 62.49,35.28 | 62.49,35.28 59.29,35.28 v58.68,34.67 | v27.44,47.32 27.74,47.62 27.74,53.95 28.81,55.02 29.49,55.02 X1.19 | v41,26.98 42.22,26.98 43.74,25.45 54.18,25.45 62.49,33.76 62.49,35.28 | v97.54,30.48 97.54,37.79 96.4,38.94 91.06,38.94 v89.31,37.19
IO4_3  (via drill 0.38)
  Top 0.152: v55.78,35.97 65.31,35.97 IC5.20 65.31,36.04 65.31,36.73 66.98,38.41 v87.25,38.41 | v54.26,33.6 52.81,33.6 52.66,33.45 IC2.8 52.58,33.38 52.35,33.15 v49.53,33.15 | v31.17,54.79 20.5,54.79 v19.51,55.78 | v33.99,27.66 35.29,26.37 41.23,26.37 44.35,29.49 v44.35,29.87 | v94.19,31.24 95.56,29.87 96.02,29.87 IC1.8 | v92.66,32.77 92.66,32.99 v91.37,34.29
  Bottom 0.152: v55.78,35.97 54.26,34.44 v54.26,33.6 | v31.17,54.79 30.64,54.79 30.41,54.56 29.57,54.56 X1.20 | v19.51,55.78 17.38,53.64 17.38,46.41 12.88,41.91 12.88,33.15 18.37,27.66 v33.99,27.66 | v44.35,29.87 46.26,29.87 v49.53,33.15 | v92.66,32.77 v94.19,31.24 | v87.25,38.41 v91.37,34.29
IO4_4  (via drill 0.38)
  Top 0.152: v66.6,37.19 66.6,36.12 65.84,35.36 65.38,35.36 IC5.21 | v48.7,33.38 45.95,33.38 IC2.13 | v30.71,54.03 20.43,54.03 v19.51,54.94 | v40.54,31.32 v37.8,31.32 | v84.05,32.54 86.72,29.87 89.31,29.87 IC1.13
  Bottom 0.152: 65.54,37.19 52.51,37.19 49.42,34.1 | 65.54,37.19 v66.6,37.19 | v48.7,33.38 49.42,34.1 | v30.71,54.03 29.57,54.03 X1.21 | v19.51,54.94 19.51,47.93 13.49,41.91 13.49,32.99 17.38,29.11 35.59,29.11 v37.8,31.32 | v40.54,31.32 40.77,31.32 42.68,29.41 43.51,29.41 44.58,28.35 47.86,28.35 50.83,31.32 50.83,32.69 49.42,34.1 | v84.05,32.54 77.5,39.09 65.92,39.09 65.54,38.71 65.54,37.19
IO4_5  (via drill 0.38)
  Top 0.152: v59.9,33.3 61.19,34.59 65.31,34.59 IC5.22 65.38,34.67 66.6,34.67 69.8,31.47 71.1,31.47 71.25,31.32 v71.63,31.32 | v54.64,30.33 49.46,30.33 47.71,32.08 45.95,32.08 IC2.14 45.88,32.08 45.34,31.55 v41.38,31.55 | v28.35,53.03 28.35,49 30.41,46.94 30.41,38.94 v32.31,37.03 | v87.25,28.58 IC1.14
  Bottom 0.152: v59.9,33.3 57.61,33.3 v54.64,30.33 | v28.35,53.03 28.81,53.49 29.49,53.49 X1.22 | v32.31,37.03 32.69,37.03 33.91,35.81 37.49,35.81 41.38,31.93 v41.38,31.55 | v87.25,28.58 85.58,28.58 82.99,31.17 78.87,31.17 78.72,31.32 v71.63,31.32
IO4_6  (via drill 0.38)
  Top 0.152: v61.88,33.98 65.31,33.98 IC5.23 65.38,34.06 v66.37,34.06 | v55.71,29.26 54.03,29.26 53.65,28.88 47.48,28.88 | 47.48,28.88 46.49,28.88 45.95,28.35 IC2.17 | v30.71,52.58 30.71,39.47 v32.31,37.87 | 47.48,28.88 v47.48,28.96 | IC1.17 88.93,24.77 88.02,25.68 88.02,26.44 88.32,26.75 90.61,26.75 90.76,26.9 90.76,27.66 90.45,27.96 87.02,27.96 83.21,31.78 v83.21,32.54 | v69.5,36.5 69.5,36.12 68.13,34.75 v68.13,34.67
  Bottom 0.152: v61.88,33.98 57.15,29.26 v55.71,29.26 | v30.71,52.58 30.26,53.03 29.57,53.03 X1.23 | v32.31,37.87 34.07,36.12 37.65,36.12 43.74,30.02 43.74,29.64 44.43,28.96 v47.48,28.96 | v83.21,32.54 80.47,35.28 71.71,35.28 70.49,36.5 v69.5,36.5 | v68.13,34.67 66.98,34.67 v66.37,34.06
IO4_7  (via drill 0.38)
  Top 0.152: v62.87,33.3 65.31,33.3 IC5.24 | IC2.18 46.41,27.05 49.46,24 v50.3,24 51.97,22.33 v51.97,13.11 | v28.05,46.71 28.05,37.87 38.33,27.58 v39.55,27.58 | v77.88,15.93 85.42,23.47 89.31,23.47 IC1.18
  Bottom 0.152: v62.87,33.3 62.49,33.3 53.19,24 50.37,24 | v28.05,46.71 28.05,51.74 28.81,52.5 29.49,52.5 X1.24 | v39.55,27.58 42.98,24.16 44.66,24.16 45.04,23.77 45.04,23.24 44.73,22.94 44.73,21.49 44.89,21.34 47.71,21.34 50.37,24 | 50.37,24 v50.3,24 | v77.88,15.93 68.13,15.93 65.31,13.11 v51.97,13.11
LADC  (via drill 0.38)
  Top 0.152: v72.01,29.49 72.01,30.1 72.62,30.71 73,30.71 IC5.11 | v66.07,15.16 66.07,13.72 60.66,8.31 IC6.1 60.58,8.31 60.43,8.46 58.22,8.46 R29.2
  Bottom 0.152: v72.01,29.49 72.01,29.11 73.99,27.13 73.99,21.49 72.78,20.27 71.18,20.27 v66.07,15.16
LCLOCK
  Top 0.152: X2.3 76.2,10.82 88.17,22.78 90.45,22.78 90.76,23.09 90.76,25.15 89.92,25.98 89.39,25.98 IC1.16
LCLR
  Top 0.152: IC1.19 89.31,22.17 88.7,22.17 77.04,10.52 77.04,9.14 X2.4
LD_/C  (via drill 0.38)
  Top 0.152: IC5.29 65,30.1 55.17,20.27 v55.17,19.51
  Bottom 0.152: v55.17,19.51 50.53,19.51 50.37,19.36 39.4,19.36 35.36,23.39 33.38,23.39 31.25,25.53 23.17,25.53 22.86,25.83 18.37,25.83 4.5,39.7 4.5,52.43 11.05,58.98 20.2,58.98 21.87,57.3 26.14,57.3 28.88,60.05 29.49,60.05 X1.9
LDIN
  Top 0.152: IC1.15 89.31,27.28 88.4,27.28 75.44,14.33 75.44,9.14 X2.2
LEDK1
  Bottom 0.152: R37.2 22.71,54.18 22.71,51.89 23.86,50.75 23.86,50.06 27.82,46.1 29.49,46.1 X1.37
LEDK2  (via drill 0.38)
  Top 0.152: v26.52,46.56 26.52,49.07 25.3,50.29 15.4,50.29 12.2,47.09 12.2,46.1 12.88,45.41 12.88,44.73 R38.2
  Bottom 0.152: v26.52,46.56 26.9,46.56 27.89,45.57 29.49,45.57 X1.38
LEDK3
  Bottom 0.152: R39.2 29.42,44.96 29.49,45.03 X1.39
LEDK4
  Bottom 0.152: R40.2 24.54,42.44 26.75,42.44 28.81,44.5 29.49,44.5 X1.40
LHVTRIG  (via drill 0.38)
  Top 0.152: v69.65,28.12 68.36,29.41 65.38,29.41 IC5.30 | v75.67,21.26 v73.39,23.55 | v91.83,23.55 92.97,23.55 94.87,21.64 97.24,21.64 100.28,24.69 100.28,25.22 105.01,29.95 109.66,29.95 110.49,29.11 R13.1
  Bottom 0.152: v69.65,28.12 71.1,28.12 73.39,25.83 v73.39,23.55 | v75.67,21.26 89.54,21.26 v91.83,23.55
LLED  (via drill 0.38)
  Top 0.152: R44.1 17.07,44.65 16.92,44.5 16.92,42.21 R42.1 17,42.21 17.84,41.38 19.59,41.38 20.35,42.14 20.65,42.14 R43.1 20.65,42.06 20.65,41.53 v21.11,41.07 | v71.18,33.3 72.39,32.08 73,32.08 IC5.13 | v50.14,19.96 v51.21,21.03 | v34.83,27.66 34.83,29.95 25.3,39.47 23.47,39.47 22.71,40.23 R41.1 22.71,40.31 23.47,41.07 v23.47,41.22
  Bottom 0.152: v71.18,33.3 69.96,33.3 65.23,28.58 65.23,25.83 60.43,21.03 v51.21,21.03 | v50.14,19.96 42.52,19.96 v34.83,27.66 | v21.11,41.07 23.32,41.07 v23.47,41.22
LOPA  (via drill 0.38)
  Top 0.152: v99.98,20.8 98.84,19.66 R20.1 | v113.54,28.73 114.53,29.72 H1.3 | v64.24,5.71 IC6.3
  Bottom 0.152: v113.54,28.73 105.85,28.73 100.59,23.47 100.59,22.25 99.98,21.64 v99.98,20.8 94.19,15.01 80.7,15.01 71.4,5.71 v64.24,5.71
LRD  (via drill 0.38)
  Top 0.152: IC5.10 74.22,30.1 v76.2,28.12 | v74.38,20.8 74.38,18.82 v70.87,15.32 | v41.08,17.22 34.68,23.62 28.73,23.62 v26.22,26.14
  Bottom 0.152: v76.2,28.12 76.2,26.75 77.42,25.53 77.42,23.85 v74.38,20.8 | v70.87,15.32 67.97,15.32 65.16,12.5 45.8,12.5 v41.08,17.22 | v26.22,26.14 18.52,26.14 4.81,39.85 4.81,52.27 10.14,57.61 15.85,57.61 16.46,57 26.83,57 28.81,58.98 29.49,58.98 X1.11
LRESET  (via drill 0.38)
  Top 0.152: v55.71,33.38 57,32.08 65.31,32.08 IC5.26 | v54.87,34.21 53.88,34.21 53.8,34.14 48.24,34.14 47.17,35.2 39.63,35.2 v37.49,33.07 | v18.6,29.72 17.61,28.73 v14.56,28.73
  Bottom 0.152: v54.87,34.21 v55.71,33.38 | v37.49,33.07 32.62,33.07 29.27,29.72 v18.6,29.72 | v14.56,28.73 13.8,28.73 3.59,38.94 3.59,55.93 12.96,65.3 24.92,65.3 28.58,61.65 28.58,61.34 28.81,61.11 29.49,61.11 X1.7
LTS+  (via drill 0.38)
  Top 0.152: X5.4 84.59,10.74 91.98,10.74 X5.1 92.05,10.82 96.55,15.32 R12.2 98.68,15.39 v99.6,16.31
  Bottom 0.152: v99.6,16.31 100.89,17.6 100.89,23.32 105.47,27.89 118.34,27.89 122.61,23.62 122.61,19.58 121.7,18.67 121.7,10.21 F1.P$4
LTS-
  Top 0.152: X5.3 84.59,1.91 91.98,1.91 X5.2 92.05,1.91 92.44,2.29 92.44,8.84 97.16,13.56 98.68,13.56 R12.1 98.68,13.64 100.59,15.54 100.59,25.07 105.16,29.64 106.23,29.64 109.2,26.67 113.16,26.67 115.68,29.19 115.68,31.93 118.72,34.98 125.05,34.98 125.28,34.75 125.28,29.26 121.7,25.68 121.7,20.35 F1.P$3
LVSEL
  Top 0.152: IC5.14 73.08,32.77 78.03,32.77 78.41,33.15 88.55,33.15 89.31,32.38 IC1.11
LWR  (via drill 0.38)
  Top 0.152: v74.07,29.41 73.08,29.41 IC5.9 | v70.03,32.08 69.88,32.08 67.44,34.52 v67.44,37.19 | v66.15,38.48 42.68,38.48 39.7,35.51 39.48,35.51 37.8,33.83 36.58,33.83 34.6,35.81 33.91,35.81 32.92,36.8 32.92,56.84 v30.71,59.05
  Bottom 0.152: v74.07,29.41 72.93,29.41 72.09,30.25 70.64,30.25 70.03,30.86 v70.03,32.08 | v66.15,38.48 v67.44,37.19 | v30.71,59.05 30.26,59.51 29.57,59.51 X1.10
N$1
  Top 0.152: R1.1 97.54,51.05 97.54,49.07 96.47,48.01 96.47,43.81 93.73,41.07 93.73,37.49 90.76,34.52 90.76,32 90.45,31.7 88.24,31.7 88.02,31.47 88.02,30.71 88.17,30.56 91.37,30.56 92.74,29.19 92.74,25.07 95.56,22.25 96.02,22.25 IC1.2
N$2
  Top 0.152: R2.1 96.25,25.83 96.09,25.98 IC1.5
N$3
  Top 0.152: R3.1 99.29,30.63 99.29,30.1 96.55,27.36 96.09,27.36 IC1.6
N$4
  Top 0.152: R4.1 101.58,34.14 101.58,33.22 99.75,31.39 96.32,31.39 96.09,31.17 IC1.9
N$5
  Top 0.152: R5.1 111.49,45.57 110.27,45.57 109.43,46.41 108.44,46.41 107.68,45.64 107.68,45.19 107.52,45.03 103.64,45.03 103.56,45.11 103.1,45.11 101.96,43.97 101.96,42.37 97.39,37.79 97.39,32 97.24,31.85 91.06,31.85 90.38,31.17 89.39,31.17 IC1.12
N$6
  Top 0.152: T8.1 97.31,65.91 98.38,66.98 103.03,66.98 108.74,61.27 112.32,61.27 SG1.-
N$7
  Top 0.152: T4.3 108.89,45.72 107.6,44.42 107.52,44.42 101.66,38.56 101.66,35.97 R4.2
N$8
  Top 0.152: T5.3 113.47,41.91 111.56,43.81 R5.2
N$9
  Top 0.152: 105.58,27.55 102.65,24.61 102.65,20.35 F1.P$1 | 105.58,27.55 105.62,27.58 105.62,29.03 D2.A | 105.58,27.55 105.62,27.51 107.9,27.51 109.05,26.37 116.21,26.37 121.85,32 H1.4
N$10
  Top 0.152: R7.1 97.46,54.86 T1.1
N$11
  Top 0.152: T2.1 110.88,41.91 111.56,41.22 117.05,41.22 120.32,44.5 120.32,46.02 121.39,47.09 121.7,47.09 121.85,47.24 121.85,49.91 121.09,50.67 R8.1
N$12
  Top 0.152: T3.1 123.22,55.47 121.09,53.34 R9.1
N$13
  Top 0.152: T1.3 99.45,51.21 99.29,51.05 R1.2
N$14
  Top 0.152: T2.3 108.21,39.85 108.21,36.73 99.06,27.58 R2.2
N$15  (via drill 0.38)
  Top 0.152: v114.38,47.85 118.57,47.85 119.18,48.46 119.18,53.03 122.76,56.62 122.84,56.62 124.13,57.91 T3.3 | v107.22,40.77 107.22,40.08 102.11,34.98 100.97,34.98 99.37,33.38 99.37,32.38 R3.2
  Bottom 0.152: v114.38,47.85 107.29,40.77 v107.22,40.77
N$16
  Top 0.152: T4.1 107.98,43.74 109.96,43.74 111.03,44.81 112.7,44.81 115.45,47.55 120.71,47.55 121.01,47.85 R10.1
N$17  (via drill 0.38)
  Top 0.152: 103.79,54.86 103.79,51.05 C1.2 | 122.76,45.34 122.76,47.85 R10.2 122.76,47.93 122.76,50.67 | 122.76,50.67 122.76,53.34 R9.2 122.84,53.34 124.82,55.32 124.82,58.45 124.67,58.6 v108.51,58.6 | 122.76,50.67 R8.2 | IC7.7 121.92,44.5 122.76,45.34 | 122.76,45.34 R11.2 | v104.78,54.86 103.79,54.86 | 103.79,54.86 R7.2
  Bottom 0.152: v108.51,58.6 v104.78,54.86
N$18  (via drill 0.38)
  Top 0.152: R11.1 121.09,45.34 121.09,43.59 121.39,43.28 121.39,41 123.68,38.71 124.52,38.71 125.05,38.18 125.05,35.81 124.9,35.66 121.54,35.66 120.71,36.5 120.71,36.96 IC7.1 120.63,37.03 118.95,37.03 C6.1 118.88,37.03 117.73,35.89 114.53,35.89 113.73,35.09 | C1.1 101.96,51.05 101.96,47.24 C5.1 101.88,47.24 v101.88,45.87 | 109.92,28.31 109.96,28.27 111.1,28.27 111.49,28.65 111.49,32.84 113.73,35.09 | 109.92,28.31 109.2,29.03 108.21,29.03 D2.C | v109.43,27.28 109.43,27.81 109.92,28.31 | v106.38,41 106.61,41 106.99,41.38 107.83,41.38 108.59,40.61 108.67,40.61 109.5,39.78 109.5,39.32 113.73,35.09
  Bottom 0.152: v109.43,27.28 105.31,27.28 101.66,23.62 101.66,19.58 102.57,18.67 102.57,10.21 F1.P$2 | v101.88,45.87 101.88,45.57 101.05,44.73 101.05,42.6 102.65,41 v106.38,41
N$19
  Top 0.152: 8.81,28.99 5.8,32 H2.4 | 8.81,28.99 8.84,28.96 13.95,28.96 14.79,29.79 15.09,29.79 D1.A | 8.81,28.99 5.11,25.3 5.11,20.57 F2.P$1
N$20  (via drill 0.38)
  Top 0.152: v14.1,41.68 13.8,41.99 12.43,41.99 11.74,41.3 11.74,39.55 10.98,38.79 9.83,38.79 9.61,39.01 9.61,40.08 8.62,41.07 8.62,46.18 R15.1 | v30.33,36.88 30.71,36.88 38.18,29.41 v40.24,29.41 | v50.98,26.06 52.35,26.06 52.58,25.83 IC2.2
  Bottom 0.152: v14.1,41.68 16.31,41.68 19.82,38.18 19.82,37.64 20.58,36.88 v30.33,36.88 | v40.24,29.41 43.59,26.06 v50.98,26.06
N$21
  Top 0.152: R13.2 112.25,29.11 112.25,31.93 114.53,34.21 H1.1
N$22
  Top 0.152: T8.3 95.03,63.93 95.79,63.93 98,66.14 100.06,66.14 R14.2
N$24
  Top 0.152: R16.1 25.38,51.05 29.8,46.63 29.8,38.25 37.57,30.48 44.58,30.48 44.89,30.18 49.15,30.18 49.69,29.64 52.58,29.64 IC2.5
N$25
  Top 0.152: IC2.6 50.07,30.86 48.24,32.69 44.73,32.69 44.2,32.16 36.58,32.16 33.15,35.59 32.92,35.59 30.1,38.41 30.1,46.79 25.53,51.36 22.25,51.36 18.29,55.32 12.73,55.32 12.5,55.09 12.5,54.56 8.54,50.6 R17.1
N$26  (via drill 0.38)
  Top 0.152: v20.2,57.76 21.65,57.76 22.1,57.3 28.12,57.3 30.48,59.66 30.94,59.66 33.38,57.23 33.38,36.8 34.07,36.12 38.87,36.12 40.39,37.64 v40.39,38.02 | v50.37,35.89 50.91,35.89 52.13,34.67 IC2.9
  Bottom 0.152: v20.2,57.76 18.83,57.76 R18.1 | v40.39,38.02 48.24,38.02 v50.37,35.89
N$27  (via drill 0.38)
  Top 0.152: v13.19,64.69 12.96,64.92 12.96,65.76 R19.1 | v9.91,33.45 14.94,33.45 v16.16,34.67 | v35.89,33.68 36.05,33.68 37.27,32.46 43.29,32.46 45.5,34.67 IC2.12
  Bottom 0.152: v13.19,64.69 13.19,61.57 4.2,52.58 4.2,39.17 v9.91,33.45 | v16.16,34.67 31.93,34.67 32.92,33.68 v35.89,33.68
N$28  (via drill 0.38)
  Top 0.152: v24.16,47.85 20.43,47.85 v18.83,46.25 | v16.31,43.74 15.4,44.65 R44.2
  Bottom 0.152: v24.16,47.85 24.46,47.55 24.46,46.86 T13.3 | v16.31,43.74 v18.83,46.25
N$29
  Top 0.152: T6.3 10.9,46.63 9.61,46.63 9.22,47.02 7.7,47.02 6.94,46.25 R15.2
N$30
  Top 0.152: T7.3 13.19,54.56 13.03,54.56 11.28,52.81 11.28,51.05 R16.2
N$31  (via drill 0.38)
  Top 0.152: v10.37,57 10.06,56.69 8.39,56.69 T9.3 | v10.37,55.63 10.37,53.03 8.69,51.36 7.55,51.36 6.79,50.6 R17.2
  Bottom 0.152: v10.37,55.63 v10.37,57
N$32  (via drill 0.38)
  Top 0.152: v16.01,58.37 13.11,58.37 T10.3
  Bottom 0.152: v16.01,58.37 16.46,58.37 17,57.84 R18.2
N$33
  Top 0.152: T11.3 13.03,63.55 13.03,64.01 11.28,65.76 R19.2
N$35
  Top 0.152: T6.1 11.89,48.62 11.89,46.33 11.05,45.49 10.6,45.49 10.29,45.19 10.29,39.7 10.37,39.62 R22.1
N$36
  Top 0.152: T7.1 12.2,52.58 12.2,51.74 11.97,51.51 11.97,50.37 9.91,48.31 8.39,48.31 R23.1
N$37
  Top 0.152: T9.1 6.41,57.61 6.41,56.77 7.55,55.63 7.55,53.34 6.79,52.58 R24.1
N$38
  Top 0.152: T10.1 9.91,56.39 8.54,55.02 R25.1
N$39
  Top 0.152: 6.37,51.55 6.56,51.74 7.62,51.74 8.46,52.58 R24.2 | 6.37,51.55 6.02,51.21 6.02,49.91 6.63,49.3 6.63,48.31 R23.2 6.63,48.23 6.63,47.4 5.49,46.25 5.49,43.74 4.5,42.75 4.5,42.29 IC8.7 4.5,42.21 4.5,41.68 6.56,39.62 8.54,39.62 | 6.37,51.55 6.02,51.89 6.02,53.26 6.71,53.95 6.71,54.94 R25.2 | 14.18,38.48 14.18,37.57 13.72,37.11 C2.2 | 14.18,38.48 14.18,39.62 R26.2 | 8.54,39.62 R22.2 8.62,39.62 | 14.18,38.48 9.68,38.48 8.54,39.62
N$40
  Top 0.152: 25.65,26.4 25.99,26.75 27.82,26.75 29.8,24.77 C7.1 | 25.65,26.4 25.61,26.37 25.61,25.91 30.1,21.41 30.1,20.12 C8.1 | 17.57,30.75 16.77,31.55 16.77,34.9 15.63,36.04 14.94,36.04 | 17.57,30.75 17.61,30.71 17.61,29.87 D1.C | 14.94,36.04 12.81,36.04 11.82,37.03 C2.1 11.74,37.03 10.37,35.66 4.04,35.66 3.62,36.08 | R26.1 12.81,39.62 13.64,40.46 14.79,40.46 14.94,40.31 14.94,36.04 | 3.62,36.08 3.2,36.5 3.2,36.96 IC8.1 | 3.62,36.08 2.37,34.82 2.37,21.57 5.03,18.9 5.03,10.44 F2.P$2 | 25.65,26.4 25.61,26.44 23.55,26.44 18.83,31.17 18.22,31.17 17.84,30.79 17.61,30.79 17.57,30.75
N$41
  Bottom 0.152: T12.1 23.55,52.73 23.55,53.42 24.31,54.18 R37.1
N$42
  Top 0.152: R21.2 15.85,32.61 13.03,29.79 H2.1
N$43
  Top 0.152: T15.1 11.89,43.36 11.89,44.04 11.28,44.65 R38.1
N$44  (via drill 0.38)
  Top 0.152: v21.72,45.03 20.81,45.95 20.05,45.95 T14.1
  Bottom 0.152: v21.72,45.03 22.64,45.03 22.71,44.96 R39.1
N$45
  Top 0.152: T5.1 113.09,39.85 113.77,39.85 115.22,38.41 123.6,38.41 124.44,37.57 124.44,37.03 IC7.4
N$46
  Bottom 0.152: T13.1 23.55,48.84 23.55,43.2 22.79,42.44 R40.1
N$47
  Top 0.152: T11.1 12.04,61.42 8.92,61.42 2.6,55.09 2.6,41.07 5.26,38.41 6.1,38.41 6.94,37.57 6.94,37.03 IC8.4
N$48
  Top 0.152: T14.3 19.05,43.89 19.05,42.29 18.98,42.21 R43.2
N$49  (via drill 0.38)
  Top 0.152: v25.07,49.68 25.07,41 24.39,40.31 R41.2
  Bottom 0.152: v25.07,49.68 24.54,50.22 24.54,50.67 T12.3
N$50
  Top 0.152: T15.3 10.98,41.3 11.28,41.3 12.27,42.29 15.02,42.29 15.09,42.21 R42.2
N$52
  Top 0.152: R31.1 68.58,5.71 | 68.58,5.71 R32.2 | IC6.6 68.58,5.71
N$54
  Top 0.152: R30.2 58.22,4.72 58.22,6.71 R29.1 58.3,6.71 60.35,6.71 60.58,6.93 IC6.2
RADC  (via drill 0.38)
  Top 0.152: v69.58,14.33 69.58,22.4 70.26,23.09 70.26,29.64 68.51,31.39 IC5.27 | v69.58,10.06 69.58,9.53 68.58,8.53 R31.2 68.58,8.46 67.14,7.01 65.92,7.01 IC6.7
  Bottom 0.152: v69.58,10.06 v69.58,14.33
RCLOCK
  Top 0.152: IC2.16 45.88,29.57 45.42,29.57 44.43,28.58 44.43,24.38 43.82,23.77 43.82,22.86 49.23,17.45 49.23,12.8 50.91,11.12 50.91,9.14 X4.3
RCLR
  Top 0.152: IC2.19 45.95,25.76 46.49,25.76 49.53,22.71 49.53,12.95 51.67,10.82 51.67,9.14 X4.4
RDIN  (via drill 0.38)
  Top 0.152: v48.09,30.86 IC2.15 | v50.22,31.55 54.26,31.55 56.32,29.49 56.32,21.87 54.56,20.12 54.56,12.8 56.62,10.74 56.62,7.24 53.88,4.5 52.51,4.5 50.14,6.86 50.14,9.07 X4.2
  Bottom 0.152: v48.09,30.86 49.53,30.86 v50.22,31.55
RHVTRIG  (via drill 0.38)
  Top 0.152: v71.56,25.6 73,25.6 IC5.3 | v44.12,15.01 37.19,15.01 33,19.2 33,20.88 32.77,21.11 31.32,21.11 31.09,20.88 31.09,19.2 30.94,19.05 29.42,19.05 23.47,24.99 23.47,25.68 v18.6,30.56 | v17.68,31.47 17.68,32.61 R21.1
  Bottom 0.152: v71.56,25.6 67.14,25.6 63.56,22.02 63.56,14.1 63.17,13.72 45.42,13.72 v44.12,15.01 | v17.68,31.47 v18.6,30.56
ROPA  (via drill 0.38)
  Top 0.152: v28.05,32.92 30.48,32.92 R28.1 | v14.41,34.06 13.26,34.06 13.11,34.21 H2.3 | v62.26,4.5 65.84,4.5 IC6.5 | v31.17,24.77 31.17,26.52 29.27,28.42 v29.27,30.56
  Bottom 0.152: v14.41,34.06 21.42,34.06 22.56,32.92 v28.05,32.92 29.27,31.7 v29.27,30.56 | v62.26,4.5 56.93,4.5 50.83,10.59 46.87,10.59 40.24,17.22 40.24,18.06 35.21,23.09 32.85,23.09 v31.17,24.77
RTS+
  Top 0.152: F2.P$4 28.05,14.33 28.05,14.63 R27.2 28.05,14.25 31.78,14.25 35.21,10.82 X3.4 35.29,10.74 42.68,10.74 X3.1
RTS-
  Top 0.152: F2.P$3 24.16,20.57 28.05,16.69 28.05,16.38 R27.1 28.12,16.31 34.68,16.31 39.25,11.73 44.12,11.73 44.28,11.58 44.28,3.58 42.68,1.98 X3.2 42.68,1.91 35.29,1.91 X3.3
RVSEL
  Top 0.152: IC5.25 65.31,32.69 59.67,32.69 59.29,33.07 59.29,34.9 58.83,35.36 54.94,35.36 53.8,36.5 46.49,36.5 45.95,35.97 IC2.11
SPKR  (via drill 0.38)
  Top 0.152: v78.49,30.71 77.8,31.39 73.08,31.39 IC5.12 | v102.87,41.6 v100.59,39.32 | v106.15,46.48 106.15,62.86 102.87,66.14 101.88,66.14 R14.1
  Bottom 0.152: v78.49,30.71 82.99,30.71 85.73,27.96 92.36,27.96 94.26,26.06 94.72,26.06 100.59,31.93 v100.59,39.32 | v102.87,41.6 102.87,43.2 v106.15,46.48
TCK
  Top 0.152: IC5.35 65.38,26.14 65.84,26.14 66.45,25.53 66.45,16.38 65.46,15.39 65.46,14.4 SV1.3
  Bottom 0.152: S5.4 106.91,38.25 106.91,37.79 89.08,19.96 71.71,19.96 66.15,14.4 65.46,14.4 SV1.3
TDI
  Top 0.152: IC5.37 65.38,24.84 65.84,24.84 66.15,24.54 66.15,20.19 60.35,14.4 SV1.5
  Bottom 0.152: S7.4 50.53,17.68 53.19,15.01 59.67,15.01 SV1.5
TDO
  Top 0.152: SV1.6 65.31,21.87 65.31,24.23 IC5.38
TEST
  Top 0.152: IC5.1 73,24.23 71.86,24.23 70.03,22.4 70.03,14.86 70.49,14.4 SV1.1
TMS  (via drill 0.38)
  Top 0.152: IC5.36 65.31,25.53 64.93,25.53 60.51,21.11 60.51,17.98 57.15,14.63 57.15,14.02 57.46,13.72 62.26,13.72 62.87,14.33 SV1.4 | v28.66,28.5 v18.29,38.86
  Bottom 0.152: v18.29,38.86 16.16,38.86 S6.4 | v28.66,28.5 34.83,28.5 42.75,20.57 50.37,20.57 50.83,20.12 57.15,20.12 62.87,14.4 SV1.4
VBAT  (via drill 0.38)
  Top 0.152: v68.28,30.79 65.38,30.79 IC5.28 | v95.64,38.33 96.02,38.33 101.12,43.43 R46.2 101.2,43.43 101.66,43.89 v101.66,44.5 | v103.33,44.5 103.33,43.43 R45.1
  Bottom 0.152: v68.28,30.79 68.28,31.17 69.8,32.69 81.39,32.69 82.15,31.93 89.84,31.93 95.64,37.72 v95.64,38.33 | v101.66,44.5 v103.33,44.5
VCC  (via drill 0.38)
  Top 0.305: v49.99,11.2 49.38,10.59 49.38,9.14 X4.1 | v73.84,9.37 74.38,9.37 74.6,9.14 X2.1 | v118.5,46.94 118.5,44.42 IC3.3 | C10.1 113.77,66.29 118.8,61.27 SG1.+
  Bottom 0.305: v49.99,11.2 67.44,11.2 69.27,9.37 v73.84,9.37 84.05,19.58 90.61,19.58 110.49,39.47 110.49,40.23 117.12,46.86 118.42,46.86 v118.5,46.94 118.5,60.88 SG1.+
XIN
  Top 0.152: IC5.6 73.08,27.51 76.59,27.51 78.11,29.03 Q3.2 78.11,29.11 79.1,30.1 79.1,32 C12.1
XOUT
  Top 0.152: 78.11,27.28 77.73,26.9 73.08,26.9 IC5.5 | 78.11,27.28 80.62,27.28 C11.1 | 78.11,27.28 Q3.1

### Text on the board
tDocu: eTapper Main R57
DrillLegend: LAYER-STACK
DrillLegend_01-16: 01-16
DrillLegend_01-20: 01-20